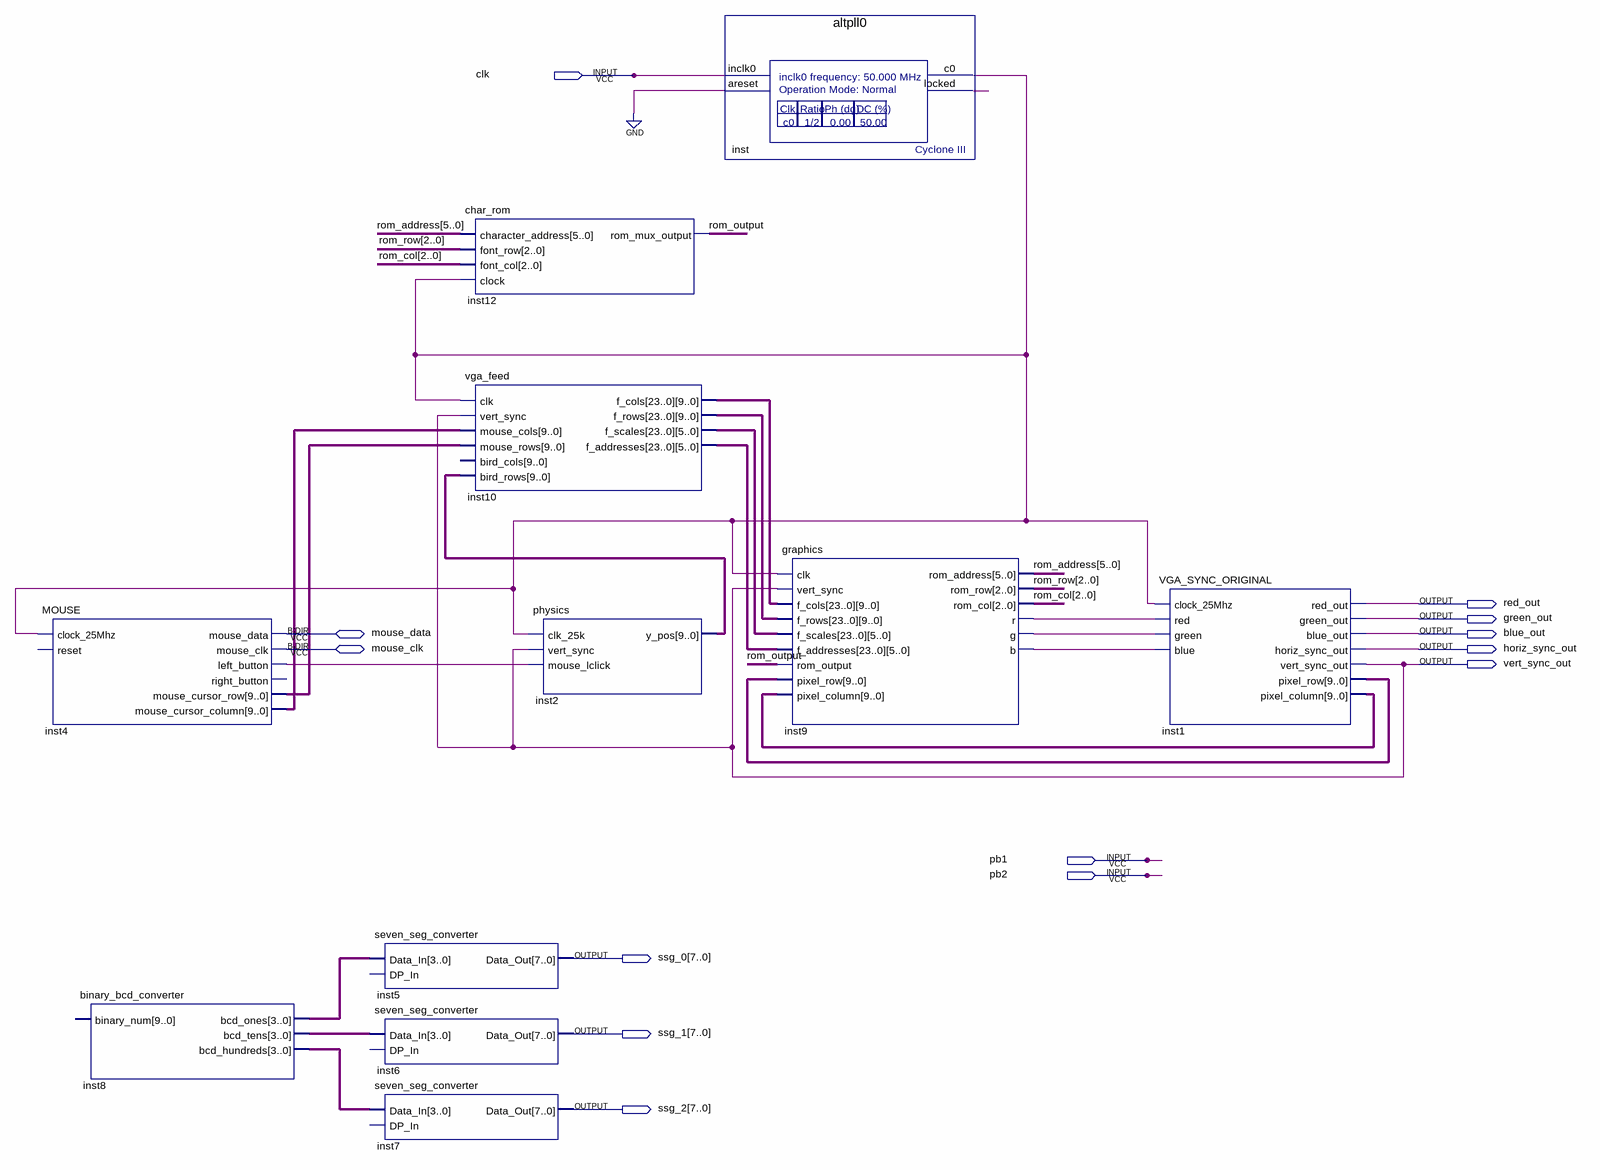
[diagram p0: schematic sheet]
// Quartus schematic graphics_test_schematic.bdf as structural Verilog: 11 symbols, 13 pins
module graphics_test_schematic (
  input  clk,
  input  pb1,
  input  pb2,
  inout  mouse_data,
  inout  mouse_clk,
  output red_out,
  output green_out,
  output blue_out,
  output horiz_sync_out,
  output vert_sync_out,
  output [7:0] ssg_0,
  output [7:0] ssg_1,
  output [7:0] ssg_2
);

  wire inst4_left_button, inst9_b, inst9_g, inst9_r, inst_c0, inst_locked, rom_output;
  wire [2:0] rom_col, rom_row;
  wire [3:0] inst8_bcd_hundreds, inst8_bcd_ones, inst8_bcd_tens;
  wire [5:0] rom_address;
  wire [9:0] inst1_pixel_column, inst1_pixel_row, inst2_y_pos, inst4_mouse_cursor_column,
       inst4_mouse_cursor_row;
  wire [143:0] inst10_f_addresses, inst10_f_scales;
  wire [239:0] inst10_f_cols, inst10_f_rows;

  MOUSE inst4 (
    .clock_25Mhz(inst_c0), .left_button(inst4_left_button), .mouse_cursor_row(inst4_mouse_cursor_row),
    .mouse_cursor_column(inst4_mouse_cursor_column), .mouse_data(mouse_data), .mouse_clk(mouse_clk));  // open: reset, right_button
  binary_bcd_converter inst8 (
    .bcd_ones(inst8_bcd_ones), .bcd_tens(inst8_bcd_tens), .bcd_hundreds(inst8_bcd_hundreds));  // open: binary_num
  seven_seg_converter inst5 (.Data_In(inst8_bcd_ones), .Data_Out(ssg_0));  // open: DP_In
  seven_seg_converter inst6 (.Data_In(inst8_bcd_tens), .Data_Out(ssg_1));  // open: DP_In
  seven_seg_converter inst7 (.Data_In(inst8_bcd_hundreds), .Data_Out(ssg_2));  // open: DP_In
  char_rom inst12 (
    .character_address(rom_address), .font_row(rom_row), .font_col(rom_col), .clock(inst_c0),
    .rom_mux_output(rom_output));
  vga_feed inst10 (
    .clk(inst_c0), .vert_sync(vert_sync_out), .mouse_cols(inst4_mouse_cursor_column),
    .mouse_rows(inst4_mouse_cursor_row), .bird_rows(inst2_y_pos), .f_cols(inst10_f_cols),
    .f_rows(inst10_f_rows), .f_scales(inst10_f_scales), .f_addresses(inst10_f_addresses));  // open: bird_cols
  physics inst2 (.clk_25k(inst_c0), .vert_sync(vert_sync_out), .mouse_lclick(inst4_left_button), .y_pos(inst2_y_pos));
  altpll0 inst (.inclk0(clk), .areset(1'b0), .c0(inst_c0), .locked(inst_locked));
  graphics inst9 (
    .clk(inst_c0), .vert_sync(vert_sync_out), .f_cols(inst10_f_cols), .f_rows(inst10_f_rows),
    .f_scales(inst10_f_scales), .f_addresses(inst10_f_addresses), .rom_output(rom_output),
    .pixel_row(inst1_pixel_row), .pixel_column(inst1_pixel_column), .rom_address(rom_address),
    .rom_row(rom_row), .rom_col(rom_col), .r(inst9_r), .g(inst9_g), .b(inst9_b));
  VGA_SYNC_ORIGINAL inst1 (
    .clock_25Mhz(inst_c0), .red(inst9_r), .green(inst9_g), .blue(inst9_b), .red_out(red_out),
    .green_out(green_out), .blue_out(blue_out), .horiz_sync_out(horiz_sync_out),
    .vert_sync_out(vert_sync_out), .pixel_row(inst1_pixel_row), .pixel_column(inst1_pixel_column));
endmodule
